# EasyEDA Pro project LisaFPGA Rev 2 EasyEDA Project.epro, schematic LisaFPGA Schematic, sheet 8 of 8

## Sheets
8 FPGA Connections: Create Date: 2025-10-28; Page Name: FPGA Connections; Update Date: 2026-01-05
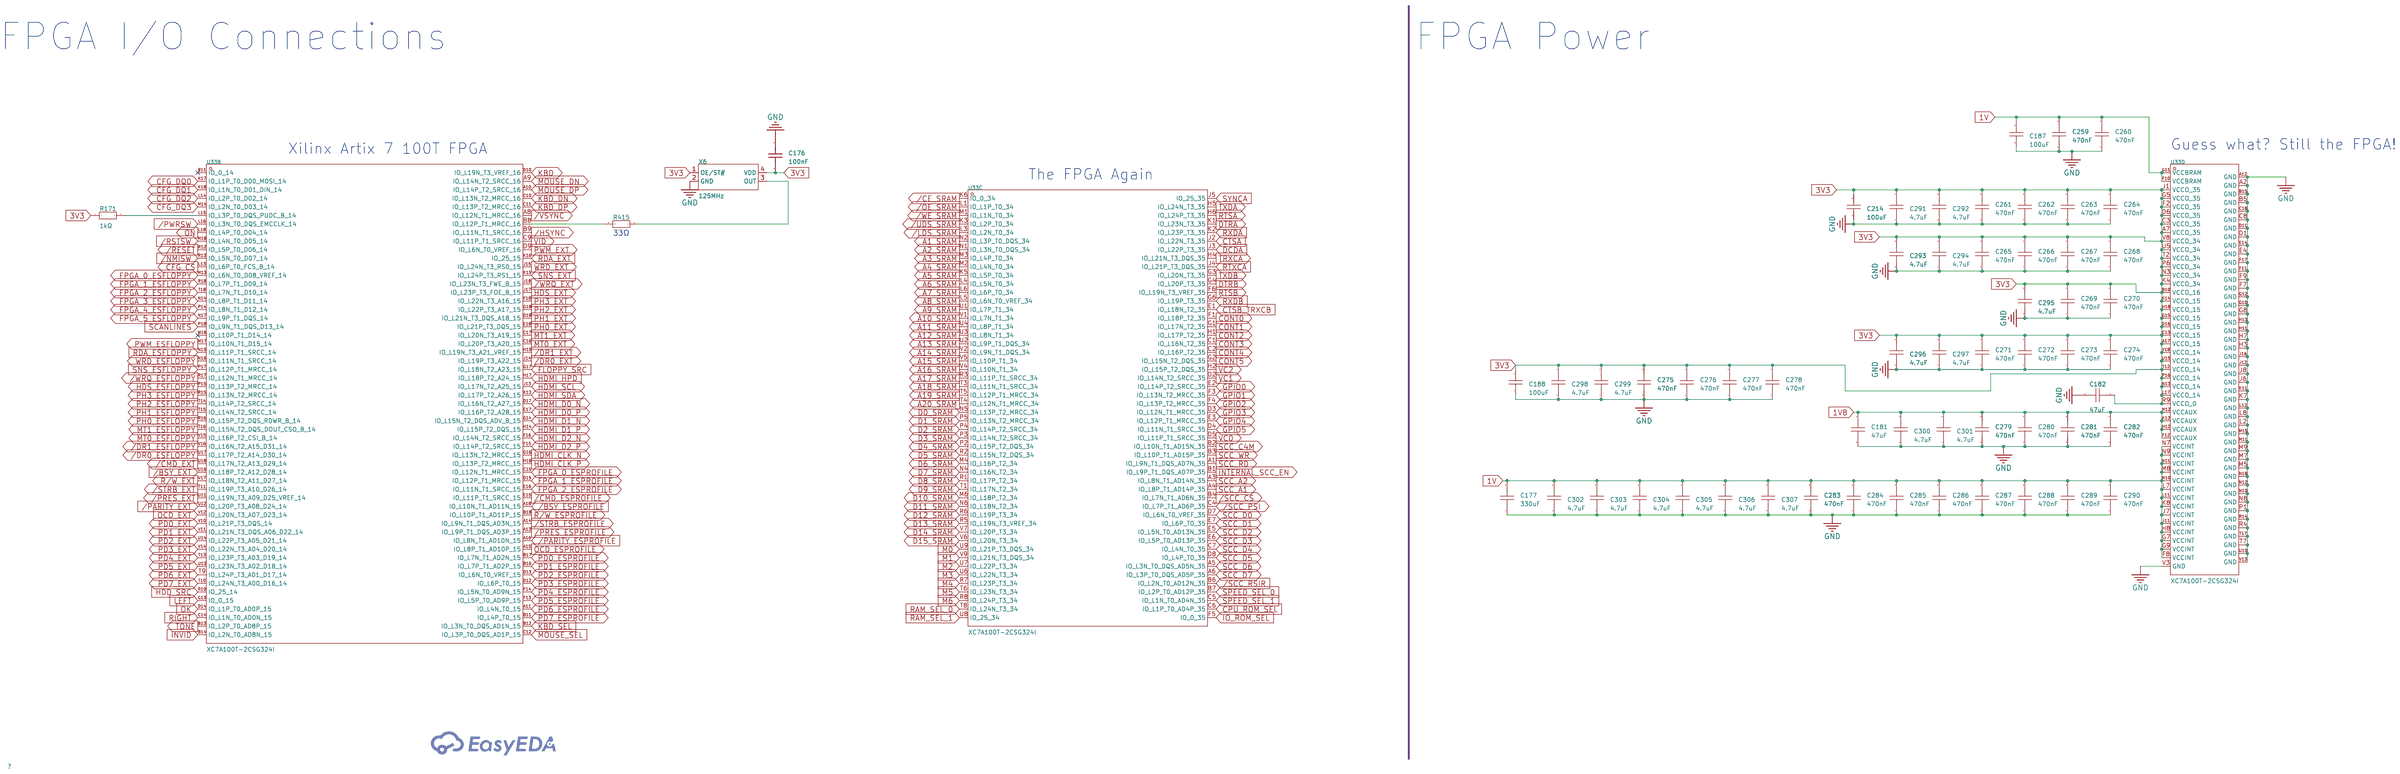
[diagram p8: FPGA Connections]

## Parts
sheet FPGA Connections
C176  100nF  [C0402]
C177  330uF  [C1210]
C181  47uF  [C1210]
C182  47uF  [C1210]
C187  100uF  [C1206]
C188  100uF  [C1206]
C214  100uF  [C1206]
C259  470nF  [C0201]
C260  470nF  [C0201]
C261  470nF  [C0201]
C262  470nF  [C0201]
C263  470nF  [C0201]
C264  470nF  [C0201]
C265  470nF  [C0201]
C266  470nF  [C0201]
C267  470nF  [C0201]
C268  470nF  [C0201]
C269  470nF  [C0201]
C270  470nF  [C0201]
C271  470nF  [C0201]
C272  470nF  [C0201]
C273  470nF  [C0201]
C274  470nF  [C0201]
C275  470nF  [C0201]
C276  470nF  [C0201]
C277  470nF  [C0201]
C278  470nF  [C0201]
C279  470nF  [C0201]
C280  470nF  [C0201]
C281  470nF  [C0201]
C282  470nF  [C0201]
C283  470nF  [C0201]
C284  470nF  [C0201]
C285  470nF  [C0201]
C286  470nF  [C0201]
C287  470nF  [C0201]
C288  470nF  [C0201]
C289  470nF  [C0201]
C290  470nF  [C0201]
C291  4.7uF  [C0201]
C292  4.7uF  [C0201]
C293  4.7uF  [C0201]
C294  4.7uF  [C0201]
C295  4.7uF  [C0201]
C296  4.7uF  [C0201]
C297  4.7uF  [C0201]
C298  4.7uF  [C0201]
C299  4.7uF  [C0201]
C300  4.7uF  [C0201]
C301  4.7uF  [C0201]
C302  4.7uF  [C0201]
C303  4.7uF  [C0201]
C304  4.7uF  [C0201]
C305  4.7uF  [C0201]
C306  4.7uF  [C0201]
C307  4.7uF  [C0201]
R171  1kΩ  [R0402]
R415  33Ω  [R0402]
X6  125MHz  [OSC-SMD_4P-L7.0-W5.0-BL-2]
sheet FPGA Programming
U33  XC7A100T-2CSG324I  [BGA-324_L15.0-W15.0-R18-C18-P0.8-TL]  (sections 1,2,3,4)

## Library data of the parts
C176 = 100nF: Supplier: LCSC; Supplier Part: C343042; Manufacturer: TDK; Manufacturer Part: CGA2B3X7R1H104KT0Y0F; JLCPCB Part Class: Extended Part; nameAlias: Value; Contributor: LCSC; spicePre: C; spiceSymbolName: CGA2B3X7R1H104KT0Y0F
C177 = GRM32ER60G337ME05L: Capacitance:330uF Tolerance:±20% Tolerance:±20% Voltage Rating:4V Temperature Coefficient:X5R; LCSC Part Name: 330uF ±20% 4V; Supplier Part: C528969; Manufacturer: muRata(村田); Supplier Footprint: 1210; JLCPCB Part Class: Extended Part; Datasheet: https://item.szlcsc.com/datasheet/GRM32ER60G337ME05L/548785.html; Supplier: LCSC; Tolerance: ±20%; Voltage Rating: 4V; Temperature Coefficient: X5R
C181 C182 = CS3225X7R476K160NRL: Capacitance:47uF Tolerance:±10% Tolerance:±10% Voltage Rating:16V Temperature Coefficient:X7R; LCSC Part Name: 47uF ±10% 16V; Supplier Part: C5440143; Manufacturer: SAMWHA(三和); Supplier Footprint: 1210; JLCPCB Part Class: Extended Part; Datasheet: https://atta.szlcsc.com/upload/public/pdf/source/20241120/90C342CED6A4517481676783052A38A7.pdf; Supplier: LCSC; Tolerance: ±10%; Voltage Rating: 16V; Temperature Coefficient: X7R
C187 C188 C214 = CL31A107MQHNNNE: Capacitance:100uF Tolerance:±20% Tolerance:±20% Voltage Rating:6.3V Temperature Coefficient:X5R; LCSC Part Name: 100uF ±20% 6.3V; Supplier Part: C15008; Manufacturer: SAMSUNG(三星); Supplier Footprint: 1206; JLCPCB Part Class: Basic Part; Datasheet: https://item.szlcsc.com/datasheet/CL31A107MQHNNNE/15681.html; Supplier: LCSC; Tolerance: ±20%; Voltage Rating: 6.3V; Temperature Coefficient: X5R
C259-C290 = MSASL063BC6474KFNB33: Capacitance:470nF Tolerance:±10% Tolerance:±10% Voltage Rating:10V Temperature Coefficient:X6S; LCSC Part Name: 470nF ±10% 10V; Supplier Part: C2169138; Manufacturer: TAIYO YUDEN(太诱); Supplier Footprint: 0201; JLCPCB Part Class: Extended Part; Datasheet: https://item.szlcsc.com/datasheet/MSASL063BC6474KFNB33/2261203.html; Supplier: LCSC; Tolerance: ±10%; Voltage Rating: 10V; Temperature Coefficient: X6S
C291-C307 = GRM035R60J475ME15D: Capacitance:4.7uF Tolerance:±20% Tolerance:±20% Voltage Rating:6.3V Temperature Coefficient:X5R; LCSC Part Name: 4.7uF ±20% 6.3V; Supplier Part: C335103; Manufacturer: muRata(村田); Supplier Footprint: 0201; JLCPCB Part Class: Extended Part; Datasheet: https://item.szlcsc.com/datasheet/GRM035R60J475ME15D/313624.html; Supplier: LCSC; Tolerance: ±20%; Voltage Rating: 6.3V; Temperature Coefficient: X5R
R171 = RC0402FR-071KL: Type:Thick Film Resistors Resistance: Tolerance:±1% Tolerance:±1% Power(Watts): Overload Voltage (Max): Temperature Coefficient:±100ppm/℃ Temperature Coefficient:±100ppm/℃ Operating Temperature Range:-55℃~+155℃ Operating Temperature Range:-55℃~+155℃; LCSC Part Name: 厚膜电阻 1kΩ ±1% 62.5mW; Supplier Part: C106235; Manufacturer: YAGEO(国巨); Supplier Footprint: 0402; JLCPCB Part Class: Extended Part; Datasheet: https://atta.szlcsc.com/upload/public/pdf/source/20180927/C295883_E8D83085EA81BD7DE0B2B681138C15EE.pdf; Supplier: LCSC; Type: Thick Film Resistors; Tolerance: ±1%; Temperature Coefficient: ±100ppm/℃; Operating Temperature Range: -55℃~+155℃
R415 = RC0402FR-0733RL: Type:Thick Film Resistor Resistance:33Ω Tolerance:±1% Tolerance:±1% Power(Watts):62.5mW Voltage-Supply(Max):50V Temperature Coefficient:±100ppm/℃ Temperature Coefficient:±100ppm/℃ Operating Temperature:-55℃~+155℃ Operating Temperature:-55℃~+155℃; LCSC Part Name: 厚膜电阻 33Ω ±1% 62.5mW; Supplier Part: C138002; Manufacturer: YAGEO(国巨); Supplier Footprint: 0402; JLCPCB Part Class: Extended Part; Datasheet: https://item.szlcsc.com/datasheet/RC0402FR-0733RL/149318.html; Supplier: LCSC; Type: Thick Film Resistor; Tolerance: ±1%; Power(Watts): 62.5mW; Voltage-Supply(Max): 50V; Temperature Coefficient: ±100ppm/℃; Operating Temperature: -55℃~+155℃
X6 = SG-8101CA 125.000000MHz TBGSA: Frequency:125MHz Frequency Stability:±15ppm Frequency Stability:±15ppm Voltage - Supply:1.8V~3.3V Voltage - Supply:1.8V~3.3V Operating Temperature:-40℃~+85℃ Operating Temperature:-40℃~+85℃; LCSC Part Name: 125MHz ±15ppm 1.8V~3.3V CMOS; Supplier Part: C390573; Manufacturer: EPSON(爱普生); Supplier Footprint: SMD7050-4P; JLCPCB Part Class: Extended Part; Datasheet: https://item.szlcsc.com/datasheet/SG-8101CA%2520125.000000MHz%2520TBGSA/366658.html; Supplier: LCSC; Frequency Stability: ±15ppm; Voltage - Supply: 1.8V~3.3V; Operating Temperature: -40℃~+85℃
U33 = XC7A100T-2CSG324I: LCSC Part Name: XC7A100T 2CSG324I -; Supplier Part: C1521791; Manufacturer: XILINX(赛灵思); Supplier Footprint: CSPBGA-324; JLCPCB Part Class: Extended Part; Supplier: LCSC

## Nets
1V: C177.2 C187.2 C259.2 C260.2 C283.2 C284.2 C285.2 C286.2 C287.2 C288.2 C289.2 C290.2 C302.2 C303.2 C304.2 C305.2 C306.2 C307.2 U33.F8(VCCINT) U33.F10(VCCBRAM) U33.G7(VCCINT) U33.G9(VCCINT) U33.G11(VCCBRAM) U33.H8(VCCINT) U33.J7(VCCINT) U33.J11(VCCINT) U33.K8(VCCINT) U33.L7(VCCINT) U33.L11(VCCINT) U33.M8(VCCINT) U33.M10(VCCINT) U33.N7(VCCINT) U33.N9(VCCINT) U33.N11(VCCINT) ; also on sheet 1
1V8: C181.1 C279.2 C280.2 C281.2 C282.2 C300.2 C301.2 U33.F12(VCCAUX) U33.H12(VCCAUX) U33.K12(VCCAUX) U33.M12(VCCAUX) ; also on sheet 1 2
3V3: C176.2 C182.1 C188.2 C214.2 C261.2 C262.2 C263.2 C264.2 C265.2 C266.2 C267.2 C268.2 C269.2 C270.2 C271.2 C272.2 C273.2 C274.2 C275.2 C276.2 C277.2 C278.2 C291.2 C292.2 C293.2 C294.2 C295.2 C296.2 C297.2 C298.2 C299.2 R171.1 U33.A7(VCCO_35) U33.A17(VCCO_15) U33.B10(VCCO_16) U33.C3(VCCO_35) U33.C13(VCCO_15) U33.D6(VCCO_35) U33.D16(VCCO_15) U33.F2(VCCO_35) U33.G5(VCCO_35) U33.G15(VCCO_15) U33.H18(VCCO_15) U33.J1(VCCO_35) U33.K4(VCCO_34) U33.K14(VCCO_15) U33.L17(VCCO_14) U33.N3(VCCO_34) U33.N13(VCCO_14) U33.P6(VCCO_34) U33.P16(VCCO_14) U33.R9(VCCO_0) U33.T2(VCCO_34) U33.T12(VCCO_14) U33.U5(VCCO_34) U33.U15(VCCO_14) U33.V8(VCCO_34) U33.V18(VCCO_14) X6.1(OE/ST#) X6.4(VDD) ; also on sheet 1 2 3 4 5 6 7
GND: C176.1 C177.1 C181.2 C182.2 C187.1 C188.1 C214.1 C259.1 C260.1 C261.1 C262.1 C263.1 C264.1 C265.1 C266.1 C267.1 C268.1 C269.1 C270.1 C271.1 C272.1 C273.1 C274.1 C275.1 C276.1 C277.1 C278.1 C279.1 C280.1 C281.1 C282.1 C283.1 C284.1 C285.1 C286.1 C287.1 C288.1 C289.1 C290.1 C291.1 C292.1 C293.1 C294.1 C295.1 C296.1 C297.1 C298.1 C299.1 C300.1 C301.1 C302.1 C303.1 C304.1 C305.1 C306.1 C307.1 U33.A2(GND) U33.A12(GND) U33.A15(IO_L8P_T1_AD10P_15) U33.B5(GND) U33.B15(GND) U33.C8(GND) U33.C18(GND) U33.D1(GND) U33.D11(GND) U33.E4(GND) U33.E14(GND) U33.F7(GND) U33.F9(GND) U33.F11(GND) U33.F17(GND) U33.G8(GND) U33.G10(GND) U33.G12(GND) U33.H3(GND) U33.H7(GND) U33.H11(GND) U33.H13(GND) U33.J6(GND) U33.J8(GND) U33.J12(GND) U33.J16(GND) U33.K7(GND) U33.K11(GND) U33.L2(GND) U33.L8(GND) U33.L12(GND) U33.M5(GND) U33.M7(GND) U33.M9(GND) U33.M11(GND) U33.M15(GND) U33.N8(GND) U33.N10(GND) U33.N12(GND) U33.N18(GND) U33.P1(GND) U33.R4(GND) U33.R14(GND) U33.T7(GND) U33.T17(GND) U33.U10(GND) U33.V3(GND) U33.V13(GND) X6.2(GND) ; also on sheet 1 2 3 4 5 6 7
/BSY_ESPROFILE: U33.A18(IO_L10N_T1_AD11N_15) ; also on sheet 3
/BSY_EXT: U33.U16(IO_L18P_T2_A12_D28_14) ; also on sheet 3
/CE_SRAM: U33.K6(IO_0_34) ; also on sheet 3
/CMD_ESPROFILE: U33.E15(IO_L11P_T1_SRCC_15) ; also on sheet 3
/CMD_EXT: U33.U18(IO_L17N_T2_A13_D29_14) ; also on sheet 3
/DR0_ESFLOPPY: U33.U17(IO_L17P_T2_A14_D30_14) ; also on sheet 4
/DR0_EXT: U33.J14(IO_L19P_T3_A22_15) ; also on sheet 4
/DR1_ESFLOPPY: U33.V16(IO_L16N_T2_A15_D31_14) ; also on sheet 4
/DR1_EXT: U33.H15(IO_L19N_T3_A21_VREF_15) ; also on sheet 4
/HSYNC: U33.B9(IO_L11N_T1_SRCC_16) ; also on sheet 6
/LDS_SRAM: U33.L3(IO_L2N_T0_34) ; also on sheet 3
/NMISW: U33.R13(IO_L5N_T0_D07_14) ; also on sheet 7
/OE_SRAM: U33.L1(IO_L1P_T0_34) ; also on sheet 3
/PARITY_ESPROFILE: U33.A16(IO_L8N_T1_AD10N_15) ; also on sheet 3
/PARITY_EXT: U33.U12(IO_L20P_T3_A08_D24_14) ; also on sheet 3
/PRES_ESPROFILE: U33.A13(IO_L9P_T1_DQS_AD3P_15) ; also on sheet 3
/PRES_EXT: U33.U11(IO_L19N_T3_A09_D25_VREF_14) ; also on sheet 3
/PWRSW: U33.L16(IO_L3N_T0_DQS_EMCCLK_14) ; also on sheet 7
/RESET: U33.R12(IO_L5P_T0_D06_14) ; also on sheet 5
/RSTSW: U33.M18(IO_L4N_T0_D05_14) ; also on sheet 7
/SCC_CS: U33.B4(IO_L7N_T1_AD6N_35) ; also on sheet 5
/SCC_PSI: U33.C4(IO_L7P_T1_AD6P_35) ; also on sheet 5
/SCC_RSIR: U33.B6(IO_L2N_T0_AD12N_35) ; also on sheet 5
/STRB_ESPROFILE: U33.A14(IO_L9N_T1_DQS_AD3N_15) ; also on sheet 3
/STRB_EXT: U33.T11(IO_L19P_T3_A10_D26_14) ; also on sheet 3
/UDS_SRAM: U33.K3(IO_L2P_T0_34) ; also on sheet 3
/VSYNC: U33.A8(IO_L12N_T1_MRCC_16) ; also on sheet 6
/WE_SRAM: U33.M1(IO_L1N_T0_34) ; also on sheet 3
/WRQ_ESFLOPPY: U33.R17(IO_L12N_T1_MRCC_14) ; also on sheet 4
/WRQ_EXT: U33.J18(IO_L23N_T3_FWE_B_15) ; also on sheet 3
A1_SRAM: U33.N2(IO_L3P_T0_DQS_34) ; also on sheet 3
A2_SRAM: U33.N1(IO_L3N_T0_DQS_34) ; also on sheet 3
A3_SRAM: U33.M3(IO_L4P_T0_34) ; also on sheet 3
A4_SRAM: U33.M2(IO_L4N_T0_34) ; also on sheet 3
A5_SRAM: U33.K5(IO_L5P_T0_34) ; also on sheet 3
A6_SRAM: U33.L4(IO_L5N_T0_34) ; also on sheet 3
A7_SRAM: U33.L6(IO_L6P_T0_34) ; also on sheet 3
A8_SRAM: U33.L5(IO_L6N_T0_VREF_34) ; also on sheet 3
A9_SRAM: U33.U1(IO_L7P_T1_34) ; also on sheet 3
A10_SRAM: U33.V1(IO_L7N_T1_34) ; also on sheet 3
A11_SRAM: U33.U4(IO_L8P_T1_34) ; also on sheet 3
A12_SRAM: U33.U3(IO_L8N_T1_34) ; also on sheet 3
A13_SRAM: U33.U2(IO_L9P_T1_DQS_34) ; also on sheet 3
A14_SRAM: U33.V2(IO_L9N_T1_DQS_34) ; also on sheet 3
A15_SRAM: U33.V5(IO_L10P_T1_34) ; also on sheet 3
A16_SRAM: U33.V4(IO_L10N_T1_34) ; also on sheet 3
A17_SRAM: U33.R3(IO_L11P_T1_SRCC_34) ; also on sheet 3
A18_SRAM: U33.T3(IO_L11N_T1_SRCC_34) ; also on sheet 3
A19_SRAM: U33.T5(IO_L12P_T1_MRCC_34) ; also on sheet 3
A20_SRAM: U33.T4(IO_L12N_T1_MRCC_34) ; also on sheet 3
CFG_CS: U33.L13(IO_L6P_T0_FCS_B_14) ; also on sheet 2
CFG_DQ0: U33.K17(IO_L1P_T0_D00_MOSI_14) ; also on sheet 2
CFG_DQ1: U33.K18(IO_L1N_T0_D01_DIN_14) ; also on sheet 2
CFG_DQ2: U33.L14(IO_L2P_T0_D02_14) ; also on sheet 2
CFG_DQ3: U33.M14(IO_L2N_T0_D03_14) ; also on sheet 2
CONT0: U33.F1(IO_L18P_T2_35) ; also on sheet 6
CONT1: U33.G1(IO_L17N_T2_35) ; also on sheet 6
CONT2: U33.H1(IO_L17P_T2_35) ; also on sheet 6
CONT3: U33.C1(IO_L16N_T2_35) ; also on sheet 6
CONT4: U33.C2(IO_L16P_T2_35) ; also on sheet 6
CONT5: U33.G2(IO_L15N_T2_DQS_35) ; also on sheet 6
CPU_ROM_SEL: U33.C6(IO_L1P_T0_AD4P_35) ; also on sheet 7
CTSA: U33.J2(IO_L22N_T3_35) ; also on sheet 5
CTSB_TRXCB: U33.E1(IO_L18N_T2_35) ; also on sheet 5
D0_SRAM: U33.N5(IO_L13P_T2_MRCC_34) ; also on sheet 3
D1_SRAM: U33.P5(IO_L13N_T2_MRCC_34) ; also on sheet 3
D2_SRAM: U33.P4(IO_L14P_T2_SRCC_34) ; also on sheet 3
D3_SRAM: U33.P3(IO_L14N_T2_SRCC_34) ; also on sheet 3
D4_SRAM: U33.P2(IO_L15P_T2_DQS_34) ; also on sheet 3
D5_SRAM: U33.R2(IO_L15N_T2_DQS_34) ; also on sheet 3
D6_SRAM: U33.M4(IO_L16P_T2_34) ; also on sheet 3
D7_SRAM: U33.N4(IO_L16N_T2_34) ; also on sheet 3
D8_SRAM: U33.R1(IO_L17P_T2_34) ; also on sheet 3
D9_SRAM: U33.T1(IO_L17N_T2_34) ; also on sheet 3
D10_SRAM: U33.M6(IO_L18P_T2_34) ; also on sheet 3
D11_SRAM: U33.N6(IO_L18N_T2_34) ; also on sheet 3
D12_SRAM: U33.R6(IO_L19P_T3_34) ; also on sheet 3
D13_SRAM: U33.R5(IO_L19N_T3_VREF_34) ; also on sheet 3
D14_SRAM: U33.V7(IO_L20P_T3_34) ; also on sheet 3
D15_SRAM: U33.V6(IO_L20N_T3_34) ; also on sheet 3
DCDA: U33.J3(IO_L22P_T3_35) ; also on sheet 5
DTRA: U33.K1(IO_L23N_T3_35) ; also on sheet 5
DTRB: U33.G4(IO_L20P_T3_35) ; also on sheet 5
FLOPPY_SRC: U33.G17(IO_L18N_T2_A23_15) ; also on sheet 4
FPGA_0_ESFLOPPY: U33.M13(IO_L6N_T0_D08_VREF_14) ; also on sheet 4
FPGA_0_ESPROFILE: U33.C15(IO_L12N_T1_MRCC_15) ; also on sheet 3
FPGA_1_ESFLOPPY: U33.R18(IO_L7P_T1_D09_14) ; also on sheet 4
FPGA_1_ESPROFILE: U33.D15(IO_L12P_T1_MRCC_15) ; also on sheet 3
FPGA_2_ESFLOPPY: U33.T18(IO_L7N_T1_D10_14) ; also on sheet 4
FPGA_2_ESPROFILE: U33.E16(IO_L11N_T1_SRCC_15) ; also on sheet 3
FPGA_3_ESFLOPPY: U33.N14(IO_L8P_T1_D11_14) ; also on sheet 4
FPGA_4_ESFLOPPY: U33.P14(IO_L8N_T1_D12_14) ; also on sheet 4
FPGA_5_ESFLOPPY: U33.N17(IO_L9P_T1_DQS_14) ; also on sheet 4
GPIO0: U33.E2(IO_L14P_T2_SRCC_35) ; also on sheet 7
GPIO1: U33.F3(IO_L13N_T2_MRCC_35) ; also on sheet 7
GPIO2: U33.F4(IO_L13P_T2_MRCC_35) ; also on sheet 7
GPIO3: U33.D3(IO_L12N_T1_MRCC_35) ; also on sheet 7
GPIO4: U33.E3(IO_L12P_T1_MRCC_35) ; also on sheet 7
GPIO5: U33.D4(IO_L11N_T1_SRCC_35) ; also on sheet 7
HDD_SRC: U33.R10(IO_25_14) ; also on sheet 3
HDMI_CLK_N: U33.G16(IO_L13N_T2_MRCC_15) ; also on sheet 6
HDMI_CLK_P: U33.H16(IO_L13P_T2_MRCC_15) ; also on sheet 6
HDMI_D0_N: U33.D17(IO_L16N_T2_A27_15) ; also on sheet 6
HDMI_D0_P: U33.E17(IO_L16P_T2_A28_15) ; also on sheet 6
HDMI_D1_N: U33.G14(IO_L15N_T2_DQS_ADV_B_15) ; also on sheet 6
HDMI_D1_P: U33.H14(IO_L15P_T2_DQS_15) ; also on sheet 6
HDMI_D2_N: U33.F16(IO_L14N_T2_SRCC_15) ; also on sheet 6
HDMI_D2_P: U33.F15(IO_L14P_T2_SRCC_15) ; also on sheet 6
HDMI_HPD: U33.H17(IO_L18P_T2_A24_15) ; also on sheet 6
HDMI_SCL: U33.J13(IO_L17N_T2_A25_15) ; also on sheet 6
HDMI_SDA: U33.K13(IO_L17P_T2_A26_15) ; also on sheet 6
HDS_ESFLOPPY: U33.P15(IO_L13P_T2_MRCC_14) ; also on sheet 4
HDS_EXT: U33.J17(IO_L23P_T3_FOE_B_15) ; also on sheet 4
INTERNAL_SCC_EN: U33.B1(IO_L9P_T1_DQS_AD7P_35) ; also on sheet 5
INVID: U33.B14(IO_L2N_T0_AD8N_15) ; also on sheet 7
IO_ROM_SEL: U33.F5(IO_0_35) ; also on sheet 7
KBD: U33.D10(IO_L19N_T3_VREF_16) ; also on sheet 7
KBD_DN: U33.C10(IO_L13N_T2_MRCC_16) ; also on sheet 7
KBD_DP: U33.C11(IO_L13P_T2_MRCC_16) ; also on sheet 7
KBD_SEL: U33.B12(IO_L3N_T0_DQS_AD1N_15) ; also on sheet 7
LEFT: U33.G13(IO_0_15) ; also on sheet 4
M0: U33.U9(IO_L21P_T3_DQS_34) ; also on sheet 7
M1: U33.V9(IO_L21N_T3_DQS_34) ; also on sheet 7
M2: U33.U7(IO_L22P_T3_34) ; also on sheet 7
M3: U33.U6(IO_L22N_T3_34) ; also on sheet 7
M4: U33.R7(IO_L23P_T3_34) ; also on sheet 7
M5: U33.T6(IO_L23N_T3_34) ; also on sheet 7
M6: U33.R8(IO_L24P_T3_34) ; also on sheet 7
MOUSE_DN: U33.A9(IO_L14N_T2_SRCC_16) ; also on sheet 7
MOUSE_DP: U33.A10(IO_L14P_T2_SRCC_16) ; also on sheet 7
MOUSE_SEL: U33.C12(IO_L3P_T0_DQS_AD1P_15) ; also on sheet 7
MT0_ESFLOPPY: U33.V15(IO_L16P_T2_CSI_B_14) ; also on sheet 4
MT0_EXT: U33.C16(IO_L20P_T3_A20_15) ; also on sheet 4
MT1_ESFLOPPY: U33.T16(IO_L15N_T2_DQS_DOUT_CSO_B_14) ; also on sheet 4
MT1_EXT: U33.C17(IO_L20N_T3_A19_15) ; also on sheet 4
OCD_EXT: U33.V12(IO_L20N_T3_A07_D23_14) ; also on sheet 3
OK: U33.D14(IO_L1P_T0_AD0P_15) ; also on sheet 4
ON: U33.L18(IO_L4P_T0_D04_14) ; also on sheet 7
PD0_ESPROFILE: U33.B17(IO_L7N_T1_AD2N_15) ; also on sheet 3
PD0_EXT: U33.V10(IO_L21P_T3_DQS_14) ; also on sheet 3
PD1_ESPROFILE: U33.B16(IO_L7P_T1_AD2P_15) ; also on sheet 3
PD1_EXT: U33.V11(IO_L21N_T3_DQS_A06_D22_14) ; also on sheet 3
PD2_ESPROFILE: U33.D13(IO_L6N_T0_VREF_15) ; also on sheet 3
PD2_EXT: U33.U14(IO_L22P_T3_A05_D21_14) ; also on sheet 3
PD3_ESPROFILE: U33.D12(IO_L6P_T0_15) ; also on sheet 3
PD3_EXT: U33.V14(IO_L22N_T3_A04_D20_14) ; also on sheet 3
PD4_ESPROFILE: U33.F14(IO_L5N_T0_AD9N_15) ; also on sheet 3
PD4_EXT: U33.T13(IO_L23P_T3_A03_D19_14) ; also on sheet 3
PD5_ESPROFILE: U33.F13(IO_L5P_T0_AD9P_15) ; also on sheet 3
PD5_EXT: U33.U13(IO_L23N_T3_A02_D18_14) ; also on sheet 3
PD6_ESPROFILE: U33.A11(IO_L4N_T0_15) ; also on sheet 3
PD6_EXT: U33.T9(IO_L24P_T3_A01_D17_14) ; also on sheet 3
PD7_ESPROFILE: U33.B11(IO_L4P_T0_15) ; also on sheet 3
PD7_EXT: U33.T10(IO_L24N_T3_A00_D16_14) ; also on sheet 3
PH0_ESFLOPPY: U33.R16(IO_L15P_T2_DQS_RDWR_B_14) ; also on sheet 4
PH0_EXT: U33.E18(IO_L21P_T3_DQS_15) ; also on sheet 3
PH1_ESFLOPPY: U33.T15(IO_L14N_T2_SRCC_14) ; also on sheet 4
PH1_EXT: U33.D18(IO_L21N_T3_DQS_A18_15) ; also on sheet 3
PH2_ESFLOPPY: U33.T14(IO_L14P_T2_SRCC_14) ; also on sheet 4
PH2_EXT: U33.G18(IO_L22P_T3_A17_15) ; also on sheet 3
PH3_ESFLOPPY: U33.R15(IO_L13N_T2_MRCC_14) ; also on sheet 4
PH3_EXT: U33.F18(IO_L22N_T3_A16_15) ; also on sheet 3
PWM_ESFLOPPY: U33.M17(IO_L10N_T1_D15_14) ; also on sheet 4
PWM_EXT: U33.D9(IO_L6N_T0_VREF_16) ; also on sheet 4
R/W_ESPROFILE: U33.B18(IO_L10P_T1_AD11P_15) ; also on sheet 3
R/W_EXT: U33.V17(IO_L18N_T2_A11_D27_14) ; also on sheet 3
RAM_SEL_0: U33.T8(IO_L24N_T3_34) ; also on sheet 3
RAM_SEL_1: U33.U8(IO_25_34) ; also on sheet 3
RDA_ESFLOPPY: U33.N15(IO_L11P_T1_SRCC_14) ; also on sheet 4
RDA_EXT: U33.K16(IO_25_15) ; also on sheet 3
RIGHT: U33.C14(IO_L1N_T0_AD0N_15) ; also on sheet 4
RTSA: U33.H6(IO_L24P_T3_35) ; also on sheet 5
RTSB: U33.F6(IO_L19N_T3_VREF_35) ; also on sheet 5
RTXCA: U33.J4(IO_L21P_T3_DQS_35) ; also on sheet 5
RXDA: U33.K2(IO_L23P_T3_35) ; also on sheet 5
RXDB: U33.G6(IO_L19P_T3_35) ; also on sheet 5
SCANLINES: U33.P18(IO_L9N_T1_DQS_D13_14) ; also on sheet 7
SCC_A1: U33.A4(IO_L8P_T1_AD14P_35) ; also on sheet 5
SCC_A2: U33.A3(IO_L8N_T1_AD14N_35) ; also on sheet 5
SCC_C4M: U33.B2(IO_L10N_T1_AD15N_35) ; also on sheet 5
SCC_D0: U33.D7(IO_L6N_T0_VREF_35) ; also on sheet 5
SCC_D1: U33.E7(IO_L6P_T0_35) ; also on sheet 5
SCC_D2: U33.E5(IO_L5N_T0_AD13N_35) ; also on sheet 5
SCC_D3: U33.E6(IO_L5P_T0_AD13P_35) ; also on sheet 5
SCC_D4: U33.C7(IO_L4N_T0_35) ; also on sheet 5
SCC_D5: U33.D8(IO_L4P_T0_35) ; also on sheet 5
SCC_D6: U33.A5(IO_L3N_T0_DQS_AD5N_35) ; also on sheet 5
SCC_D7: U33.A6(IO_L3P_T0_DQS_AD5P_35) ; also on sheet 5
SCC_RD: U33.A1(IO_L9N_T1_DQS_AD7N_35) ; also on sheet 5
SCC_WR: U33.B3(IO_L10P_T1_AD15P_35) ; also on sheet 5
SNS_ESFLOPPY: U33.P17(IO_L12P_T1_MRCC_14) ; also on sheet 4
SNS_EXT: U33.K15(IO_L24P_T3_RS1_15) ; also on sheet 3
SPEED_SEL_0: U33.B7(IO_L2P_T0_AD12P_35) ; also on sheet 7
SPEED_SEL_1: U33.C5(IO_L1N_T0_AD4N_35) ; also on sheet 7
SYNCA: U33.J5(IO_25_35) ; also on sheet 5
TONE: U33.B13(IO_L2P_T0_AD8P_15) ; also on sheet 6
TRXCA: U33.H4(IO_L21N_T3_DQS_35) ; also on sheet 5
TXDA: U33.H5(IO_L24N_T3_35) ; also on sheet 5
TXDB: U33.G3(IO_L20N_T3_35) ; also on sheet 5
VC0: U33.D5(IO_L11P_T1_SRCC_35) ; also on sheet 6
VC1: U33.D2(IO_L14N_T2_SRCC_35) ; also on sheet 6
VC2: U33.H2(IO_L15P_T2_DQS_35) ; also on sheet 6
VID: U33.C9(IO_L11P_T1_SRCC_16) ; also on sheet 6
WRD_ESFLOPPY: U33.N16(IO_L11N_T1_SRCC_14) ; also on sheet 4
WRD_EXT: U33.J15(IO_L24N_T3_RS0_15) ; also on sheet 4
$8N11378: R415.2 X6.3(OUT)
$8N11479: R415.1 U33.B8(IO_L12P_T1_MRCC_16)
$8N11542: R171.2 U33.L15(IO_L3P_T0_DQS_PUDC_B_14)

Not connected (* = marked no-connect by the designer): U33 M16(IO_L10P_T1_D14_14)* R11(IO_0_14)*

## Notes on the sheets
sheet 8
- FPGA I/O Connections
- FPGA Power
- Guess what? Still the FPGA!
- Xilinx Artix 7 100T FPGA
- The FPGA Again
- 33Ω
